# EAGLE design femto (EAGLE 6.4)
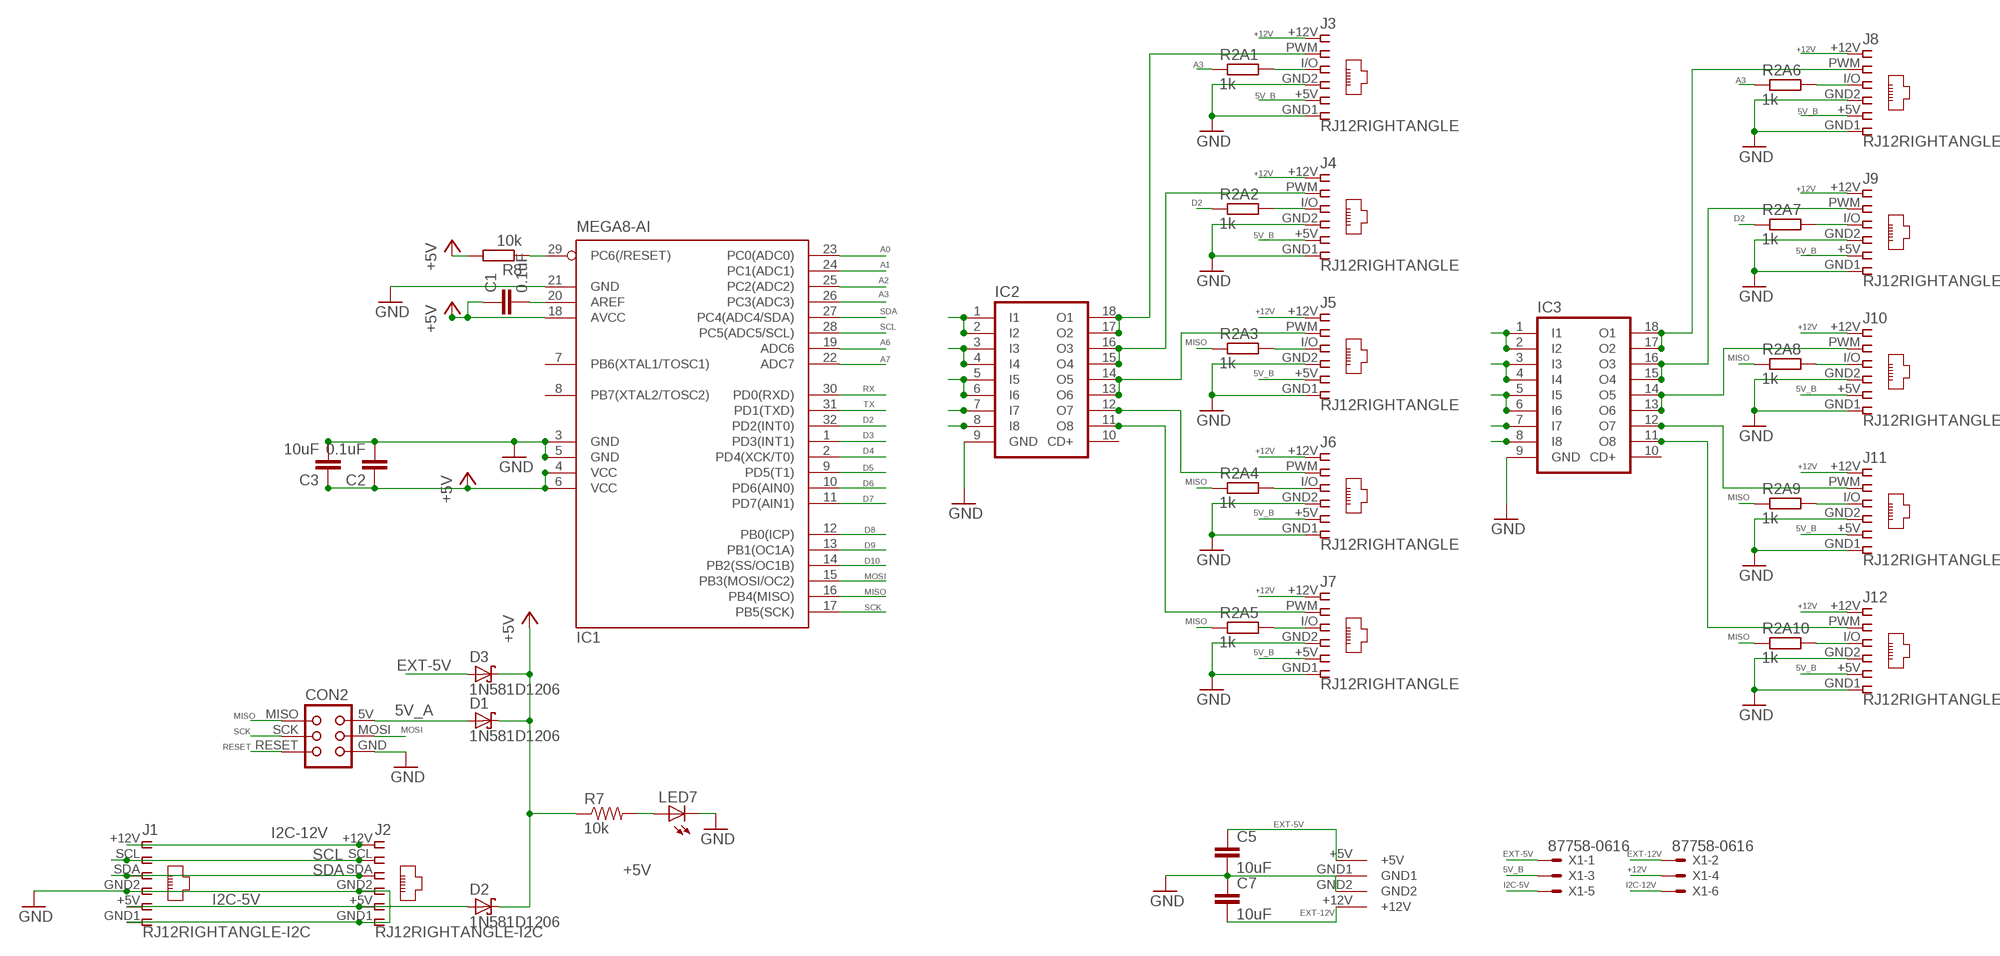
[diagram p0: schematic, sheet 1]

## Parts
C1  0.1uF  C-EUC1206  [C1206]
C2  0.1uF  C-EUC1206  [C1206]
C3  10uF  C-EUC1206  [C1206]
C5  10uF  C-EUC1206  [C1206]
C7  10uF  C-EUC1206  [C1206]
CON2  TINYISPTAG  [TC2030-MCP]
D1  1N581D1206  [LED-1206]
D2  1N581D1206  [LED-1206]
D3  1N581D1206  [LED-1206]
IC1  MEGA8-AI  [TQFP32-08]
IC2  ULN2803A  [SO18W]
IC3  ULN2803A  [SO18W]
J1  RJ12RIGHTANGLE-I2C  [RJ12-RIGHTANGLE-I2C]
J2  RJ12RIGHTANGLE-I2C  [RJ12-RIGHTANGLE-I2C]
J3  RJ12RIGHTANGLE  [RJ12-RIGHTANGLE]
J4  RJ12RIGHTANGLE  [RJ12-RIGHTANGLE]
J5  RJ12RIGHTANGLE  [RJ12-RIGHTANGLE]
J6  RJ12RIGHTANGLE  [RJ12-RIGHTANGLE]
J7  RJ12RIGHTANGLE  [RJ12-RIGHTANGLE]
J8  RJ12RIGHTANGLE  [RJ12-RIGHTANGLE]
J9  RJ12RIGHTANGLE  [RJ12-RIGHTANGLE]
J10  RJ12RIGHTANGLE  [RJ12-RIGHTANGLE]
J11  RJ12RIGHTANGLE  [RJ12-RIGHTANGLE]
J12  RJ12RIGHTANGLE  [RJ12-RIGHTANGLE]
LED7  LEDCHIP-LED0603  [CHIP-LED0603]
R2A1  1k  R-EU_M1206  [M1206]
R2A2  1k  R-EU_M1206  [M1206]
R2A3  1k  R-EU_M1206  [M1206]
R2A4  1k  R-EU_M1206  [M1206]
R2A5  1k  R-EU_M1206  [M1206]
R2A6  1k  R-EU_M1206  [M1206]
R2A7  1k  R-EU_M1206  [M1206]
R2A8  1k  R-EU_M1206  [M1206]
R2A9  1k  R-EU_M1206  [M1206]
R2A10  1k  R-EU_M1206  [M1206]
R7  10k  RESISTOR0603-RES  [0603-RES]
R8  10k  R-EU_M1206  [M1206]
U$1  KPJX-4S-S  [KPJX-4S-S]
X1  87758-0616  [87758-0616]

## Nets
5V_A: CON2.5V(VCC) D1.A
5V_B [power]: J3.+5V J4.+5V J5.+5V J6.+5V J7.+5V J8.+5V J9.+5V J10.+5V J11.+5V J12.+5V X1.3
+5V [power]: C1.1 C2.1 C3.1 D1.C D2.C D3.C IC1.4(VCC) IC1.6(VCC) IC1.18(AVCC) R7.1 R8.2
+12V: J3.+12V J4.+12V J5.+12V J6.+12V J7.+12V J8.+12V J9.+12V J10.+12V J11.+12V J12.+12V X1.4
A0: IC1.23(PC0(ADC0))
A1: IC1.24(PC1(ADC1))
A2: IC1.25(PC2(ADC2))
A3: IC1.26(PC3(ADC3)) R2A1.1 R2A6.1
A6: IC1.19(ADC6)
A7: IC1.22(ADC7)
D2: IC1.32(PD2(INT0)) R2A2.1 R2A7.1
D3: IC1.1(PD3(INT1))
D4: IC1.2(PD4(XCK/T0))
D5: IC1.9(PD5(T1))
D6: IC1.10(PD6(AIN0))
D7: IC1.11(PD7(AIN1))
D8: IC1.12(PB0(ICP))
D9: IC1.13(PB1(OC1A))
D10: IC1.14(PB2(SS/OC1B))
EXT-5V [highpower]: C5.1 D3.A U$1.+5V X1.1
EXT-12V [highpower]: C7.2 U$1.+12V X1.2
GND [power]: C2.2 C3.2 C5.2 C7.1 CON2.GND IC1.3(GND) IC1.5(GND) IC1.21(GND) IC2.9(GND) IC3.9(GND) J1.GND1 J1.GND2 J2.GND1 J2.GND2 J3.GND1 J3.GND2 J4.GND1 J4.GND2 J5.GND1 J5.GND2 J6.GND1 J6.GND2 J7.GND1 J7.GND2 J8.GND1 J8.GND2 J9.GND1 J9.GND2 J10.GND1 J10.GND2 J11.GND1 J11.GND2 J12.GND1 J12.GND2 LED7.C U$1.GND1 U$1.GND2
I2C-5V [power]: D2.A J1.+5V J2.+5V X1.5
I2C-12V: J1.+12V J2.+12V X1.6
MISO: CON2.MISO IC1.16(PB4(MISO)) R2A3.1 R2A4.1 R2A5.1 R2A8.1 R2A9.1 R2A10.1
MOSI: CON2.MOSI IC1.15(PB3(MOSI/OC2))
N$1: IC2.1(I1) IC2.2(I2)
N$2: J3.I/O R2A1.2
N$3: IC2.17(O2) IC2.18(O1) J3.PWM
N$4: C1.2 IC1.20(AREF)
N$5: IC2.15(O4) IC2.16(O3) J4.PWM
N$6: IC2.13(O6) IC2.14(O5) J5.PWM
N$7: IC2.3(I3) IC2.4(I4)
N$8: IC2.5(I5) IC2.6(I6)
N$9: J4.I/O R2A2.2
N$10: J5.I/O R2A3.2
N$11: IC2.12(O7) J6.PWM
N$12: J6.I/O R2A4.2
N$13: IC2.11(O8) J7.PWM
N$14: J7.I/O R2A5.2
N$15: LED7.A R7.2
N$16: IC2.7(I7)
N$17: IC2.8(I8)
N$18: IC3.17(O2) IC3.18(O1) J8.PWM
N$19: IC3.15(O4) IC3.16(O3) J9.PWM
N$20: IC3.13(O6) IC3.14(O5) J10.PWM
N$21: J8.I/O R2A6.2
N$22: J9.I/O R2A7.2
N$23: J10.I/O R2A8.2
N$24: IC3.12(O7) J11.PWM
N$25: J11.I/O R2A9.2
N$26: IC3.11(O8) J12.PWM
N$27: J12.I/O R2A10.2
N$28: IC3.1(I1) IC3.2(I2)
N$29: IC3.3(I3) IC3.4(I4)
N$30: IC3.5(I5) IC3.6(I6)
N$31: IC3.7(I7)
N$32: IC3.8(I8)
RESET: CON2.RESET IC1.29(PC6(/RESET)) R8.1
RX: IC1.30(PD0(RXD))
SCK: CON2.SCK IC1.17(PB5(SCK))
SCL [highpower]: IC1.28(PC5(ADC5/SCL)) J1.SCL J2.SCL
SDA [highpower]: IC1.27(PC4(ADC4/SDA)) J1.SDA J2.SDA
TX: IC1.31(PD1(TXD))
Unconnected: IC1.7(PB6(XTAL1/TOSC1)) IC1.8(PB7(XTAL2/TOSC2)) IC2.10(CD+) IC3.10(CD+)

## Library data of the parts
C1-C3 = resistor:C-EU: CAPACITOR, European symbol
C5 C7 = rcl:C-EU: CAPACITOR, European symbol
CON2 = lpatiny:TINYISP: CONNECTOR
D1-D3 = lpatiny:1N581*: 1.0A SCHOTTKY BARRIER RECTIFIER Source: http://www.diodes.com/datasheets/ds23001.pdf
IC1 = atmel:MEGA8: MICROCONTROLLER 8 Kbytes FLASH, 1 kbytes SRAM, 512 bytes EEPROM, USART, 6-channel 10 bit ADC, 2-channel 8 bit ADC Pin compatible with Atmega48, ATMega88, ATMega168 Source: avr.lbr; MPN: ATMEGA8-16AU; OC_FARNELL: 9171371; OC_NEWARK: 73M8863
IC2 IC3 = lpatiny:ULN2803A: DRIVER ARRAY
J1-J12 = lpatiny:RJ12: CORCOM Modular RJ Jacks No Shield Source: www.tycoelectronics.com .. ENG_DS_1654001_1099_RJ_L_0507.pdf
LED7 = adafruit:LED: LED OSRAM: - CHIPLED LG R971, LG N971, LY N971, LG Q971, LY Q971, LO R971, LY R971 LH N974, LH R974 LS Q976, LO Q976, LY Q976 LO Q996 - Hyper CHIPLED LW Q18S LB Q993, LB Q99A, LB R99A - SideLED LS A670, LO A670, LY A670, LG A670, LP A670 LB A673, LV A673, LT A673, LW A673 LH A674 LY A675 LS A676, LA A676, LO A676, LY A676, LW A676 LS A679, LY A679, LG A679 - Hyper Micro SIDELED® LS Y876, LA Y876, LO Y876, LY Y876 LT Y87S - SmartLED LW L88C, LW L88S LB L89C, LB L89S, LG L890 LS L89K, LO L89K, LY L89K LS L896, LA L896, LO L896, LY L896 - TOPLED LS T670, LO T670, LY T670, LG T670, LP T670 LSG T670, LSP T670, LSY T670, LOP T670, LYG T670 LG T671, LOG T671, LSG T671 LB T673, LV T673, LT T673, LW T673 LH T674 LS T676, LA T676, LO T676, LY T676, LB T676, LH T676, LSB T676, LW T676 LB T67C, LV T67C, LT T67C, LS T67K, LO T67K, LY T67K, LW E67C LS E67B, LA E67B, LO E67B, LY E67B, LB E67C, LV E67C, LT E67C LW T67C LS T679, LY T679, LG T679 LS T770, LO T770, LY T770, LG T770, LP T770 LB T773, LV T773, LT T773, LW T773 LH T774 LS E675, LA E675, LY E675, LS T675 LS T776, LA T776, LO T776, LY T776, LB T776 LHGB T686 LT T68C, LB T68C - Hyper Mini TOPLED® LB M676 - Mini TOPLED Santana® LG M470 LS M47K, LO M47K, LY M47K Source: http://www.osram.convergy.de/
R2A1-R2A10 R8 = resistor:R-EU_: RESISTOR, European symbol
R7 = SparkFun:RESISTOR: Resistor Basic schematic elements and footprints for 0603, 1206, and PTH resistors.
U$1 = lpatiny:KPJX-4S-S
X1 = con-molex:87758-0616: 6 Pin - 2mm Dual Row Single Wafer, Vertical T/H HDR Source: http://www.molex.com/pdm_docs/sd/877580616_sd.pdf; MPN: 87758-0616; OC_FARNELL: 7472323; OC_NEWARK: 25M5667

## Net classes
0 default: width 0.457 mm
1 power: width 0.457 mm
2 highpower: width 1.372 mm
3 fine: width 0.305 mm

## Board
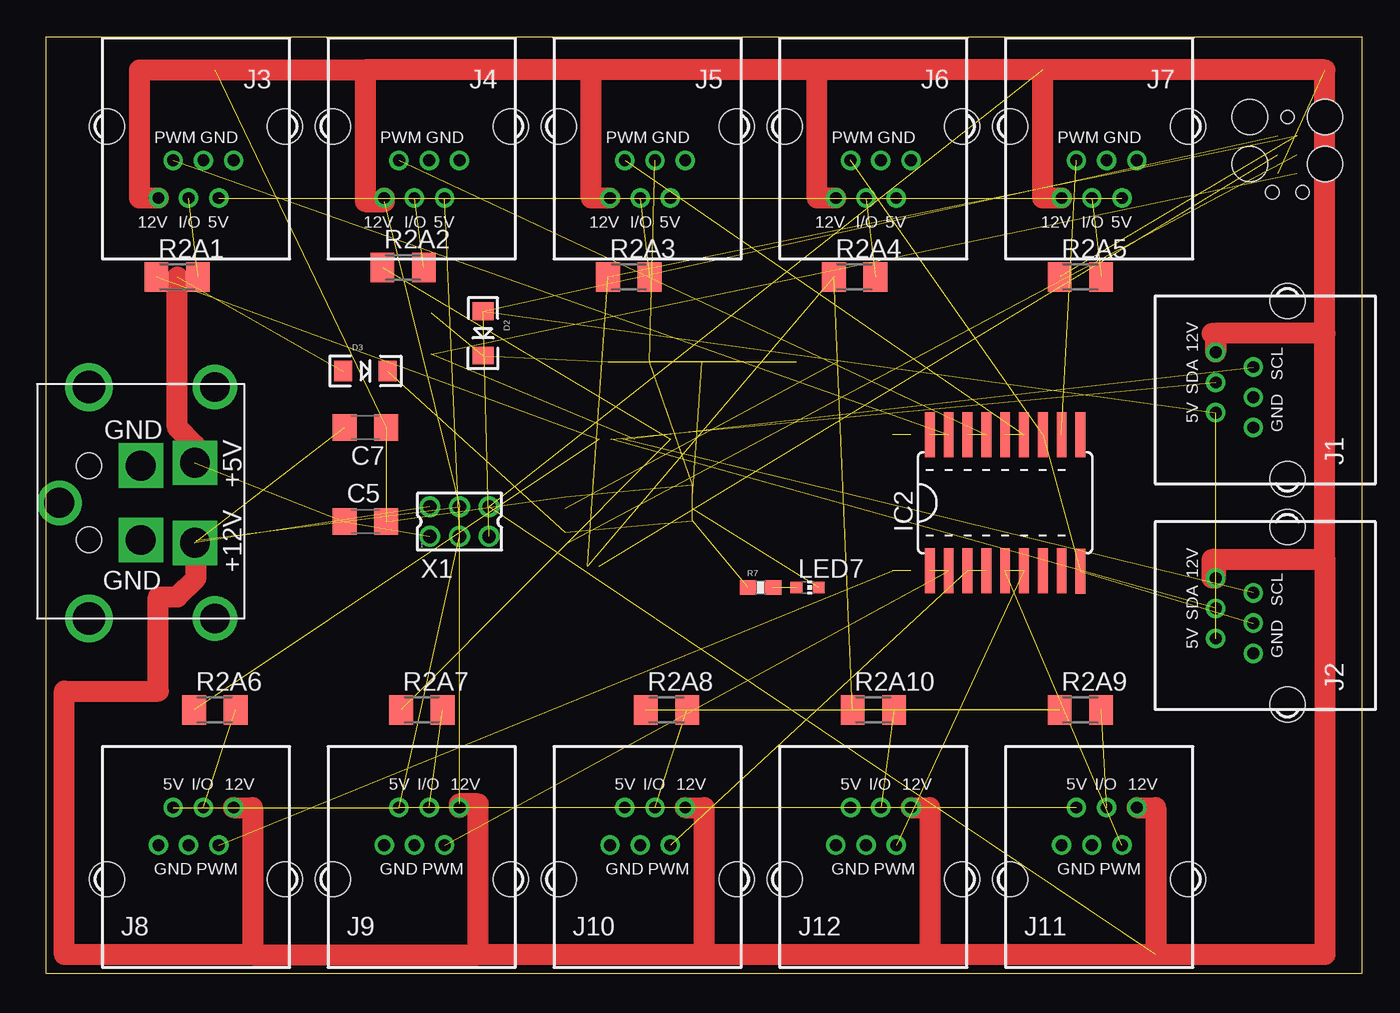
[diagram p1: board, top side]
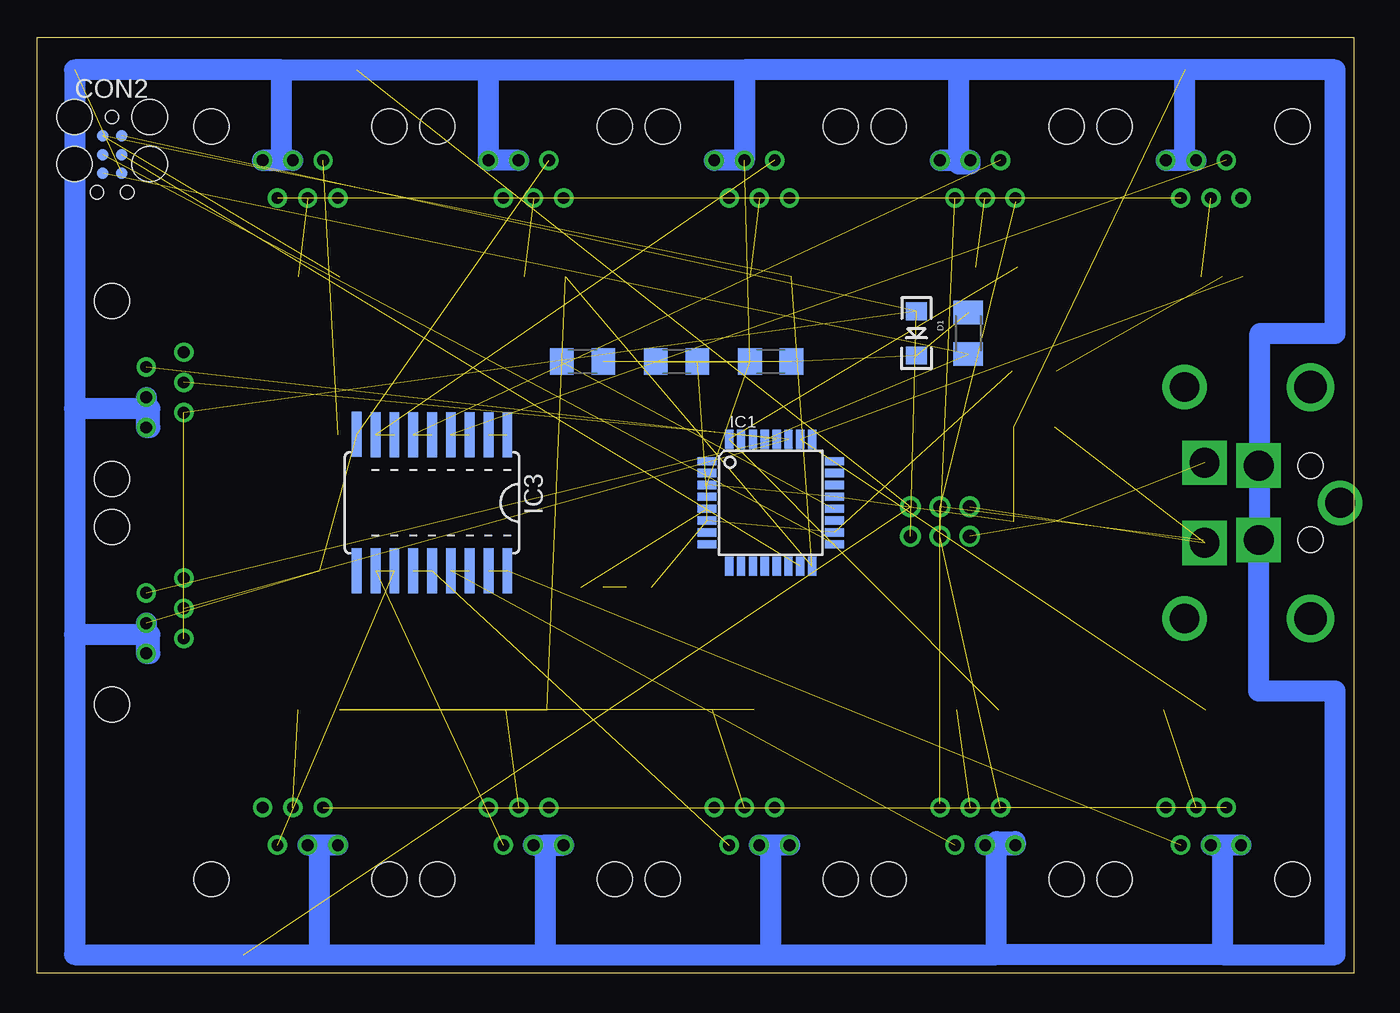
[diagram p2: board, bottom side, seen from below]

Size 88.89 x 63.17 mm. Coordinates in mm from the lower left corner, seen from the top.
Outline: 0,0 88.89,0 88.89,63.17 0,63.17 0,0
Copper layers (1*16): Top 0.035mm / dielectric 1.5mm / Bottom 0.035mm
Design rules "default": minimum track width 6mil, minimum drill 12mil, track to track 6mil, track to pad 6mil, pad to pad 6mil, via to via 6mil, smd to smd 0mil, copper to edge 10mil, drill to drill 10mil, minimum pad ring 10mil, minimum via ring 6mil, stop-mask expansion 2mil, vias tented up to drill 100mil, thermal gap 10mil
vRestrict: area 33,25.4 to 36.8,38.1; area 41.9,25.4 to 45.7,38.1; area 33,25.4 to 45.7,29.2; area 33,34.3 to 45.7,38.1; area 81.3,52.1 to 86.4,58.4

### Footprints (pad centres in the part's own frame; a part is rotated, then mirrored left to right if it is on the bottom)
C1206 = smd 1.6 x 1.8: 1 -1.4,0; 2 1.4,0
TC2030-MCP = smd 0.787 x 0.787: 5V 1.27,0.635; GND 3.81,0.635; MISO 1.27,-0.635; MOSI 2.54,0.635; RESET 3.81,-0.635; SCK 2.54,-0.635 | hole 0.889: 0,0; 5.08,-1.016; 5.08,1.016 | hole 2.375: 0,2.54; 0,-2.54; 3.175,-2.54; 3.175,2.54
LED-1206 = smd 1.2 x 1.4: A -1.5,0; C 1.5,0
TQFP32-08 = smd 1.27 x 0.559: 1 -4.293,2.8; 2 -4.293,2; 3 -4.293,1.2; 4 -4.293,0.4; 5 -4.293,-0.4; 6 -4.293,-1.2; 7 -4.293,-2; 8 -4.293,-2.8; 17 4.293,-2.8; 18 4.293,-2; 19 4.293,-1.2; 20 4.293,-0.4; 21 4.293,0.4; 22 4.293,1.2; 23 4.293,2; 24 4.293,2.8 | smd 0.559 x 1.27: 9 -2.8,-4.293; 10 -2,-4.293; 11 -1.2,-4.293; 12 -0.4,-4.293; 13 0.4,-4.293; 14 1.2,-4.293; 15 2,-4.293; 16 2.8,-4.293; 25 2.8,4.293; 26 2,4.293; 27 1.2,4.293; 28 0.4,4.293; 29 -0.4,4.293; 30 -1.2,4.293; 31 -2,4.293; 32 -2.8,4.293
SO18W = smd 0.66 x 3.048: 1 -5.08,-4.585; 2 -3.81,-4.585; 3 -2.54,-4.585; 4 -1.27,-4.585; 5 0,-4.585; 6 1.27,-4.585; 7 2.54,-4.585; 8 3.81,-4.585; 9 5.08,-4.623; 10 5.08,4.585; 11 3.81,4.585; 12 2.54,4.585; 13 1.27,4.585; 14 0,4.585; 15 -1.27,4.585; 16 -2.54,4.585; 17 -3.81,4.585; 18 -5.08,4.585
RJ12-RIGHTANGLE-I2C = drill 0.8 pad 1.3: +5V -1.54,4.84; +12V 2.54,4.84; GND1 -2.54,2.3; GND2 -0.5,2.3; SCL 1.54,2.3; SDA 0.5,4.84 | hole 2.36: -6,0; 6,0
RJ12-RIGHTANGLE = drill 0.8 pad 1.3: +5V -1.54,4.84; +12V 2.54,4.84; GND1 -2.54,2.3; GND2 -0.5,2.3; I/O 0.5,4.84; PWM 1.54,2.3 | hole 2.36: -6,0; 6,0
CHIP-LED0603 = smd 0.8 x 0.8: A 0,-0.75; C 0,0.75
M1206 = smd 1.6 x 2: 1 -1.4,0; 2 1.4,0
0603-RES = smd 1.1 x 1: 1 -0.85,0; 2 0.85,0
KPJX-4S-S = drill 2 square: +5V 2.7,1.35; +12V -2.7,1.35; GND1 -2.5,5; GND2 2.5,5 | drill 2: P$1 -7.8,0; P$2 7.8,0; P$11 0,10.5 | drill 2.2: P$3 -7.8,8.5; P$4 7.8,8.5 | hole 1.7: -2.5,8.5; 2.5,8.5
87758-0616 = drill 0.9 pad 1.27: 1 -2,-1; 2 -2,1; 3 0,-1; 4 0,1; 5 2,-1; 6 2,1

### Placement (x,y rotation side)
C1  52.07,41.27 180 bottom
C2  45.72,41.27 180 bottom
C3  39.37,41.27 180 bottom
C5  21.59,30.48 0 top
C7  21.59,36.83 180 top
CON2  83.82,57.78 270 bottom
D1  29.53,43.18 270 bottom
D2  29.53,43.18 270 top
D3  21.59,40.64 0 top
IC1  39.37,31.75 0 bottom
IC2  64.77,31.75 0 top
IC3  62.23,31.75 180 bottom
J1  83.82,39.37 90 top
J2  83.82,24.13 90 top
J3  10.16,57.15 180 top
J4  25.4,57.15 180 top
J5  40.64,57.15 180 top
J6  55.88,57.15 180 top
J7  71.12,57.15 180 top
J8  10.16,6.35 0 top
J9  25.4,6.35 0 top
J10  40.64,6.35 0 top
J11  71.12,6.35 0 top
J12  55.88,6.35 0 top
LED7  51.44,26.04 270 top
R2A1  8.89,46.99 0 top
R2A2  24.13,47.62 0 top
R2A3  39.37,46.99 0 top
R2A4  54.61,46.99 0 top
R2A5  69.85,46.99 0 top
R2A6  11.43,17.78 0 top
R2A7  25.4,17.78 0 top
R2A8  41.91,17.78 0 top
R2A9  69.85,17.78 0 top
R2A10  55.88,17.78 0 top
R7  48.26,26.04 0 top
R8  26.04,43.18 90 bottom
U$1  11.43,31.75 90 top
X1  27.94,30.48 0 top

### Tracks (layer width: path | path; a pad name or v marks a point on that pad's centre or on a via)
5V_A  (1 unrouted)
5V_B  (10 unrouted)
+5V  (10 unrouted)
+12V  (3 unrouted)
  Top 1.422: 13.97,1.27 29.21,1.27 | 29.21,1.27 29.21,11.43 27.94,11.43 J9.+12V | J10.+12V 44.45,11.19 44.45,1.27 | 44.45,1.27 29.21,1.27 | J12.+12V 59.69,11.19 59.69,1.27 | 59.69,1.27 44.45,1.27 | J11.+12V 74.93,11.19 74.93,1.27 59.69,1.27 | J3.+12V 6.35,52.31 6.35,60.96 21.59,60.96 | 21.59,60.96 21.59,52.07 22.86,52.07 J4.+12V | J5.+12V 36.83,52.31 36.83,60.96 | 36.83,60.96 21.59,60.96 | J6.+12V 52.07,52.31 52.07,60.96 | 52.07,60.96 36.83,60.96 | J7.+12V 67.31,52.31 67.31,60.96 52.07,60.96 | J8.+12V 13.97,11.19 13.97,1.27 | 13.97,1.27 1.27,1.27 1.27,19.05 7.62,19.05 7.62,25.4 8.89,25.4 10.16,26.67 10.16,29.21
A3  (2 unrouted)
D2  (2 unrouted)
EXT-5V  (3 unrouted)
  Top 1.422: U$1.+5V 10.08,35.64 8.89,36.83 8.89,46.99
EXT-12V  (2 unrouted)
GND  (12 unrouted)
  Bottom 1.422: J3.GND2 J3.GND1 11.43,54.85 11.43,60.96 | 11.43,60.96 26.67,60.96 | 26.67,54.85 26.67,54.61 25.9,54.61 J4.GND2 J4.GND1 26.67,54.85 | 26.67,54.85 26.67,60.96 | 26.67,60.96 41.14,60.96 | 41.14,60.96 J5.GND2 J5.GND1 | J6.GND2 J6.GND1 58.42,60.96 | 58.42,60.96 41.14,60.96 | 72.39,54.85 J7.GND2 J7.GND1 72.39,54.85 | 72.39,60.96 58.42,60.96 | 8.89,8.65 J8.GND2 J8.GND1 8.89,8.65 | 8.89,1.27 24.13,1.27 | 24.13,1.27 24.13,8.89 22.86,8.89 J9.GND1 J9.GND2 | J10.GND1 J10.GND2 39.37,8.65 39.37,1.27 | 39.37,1.27 24.13,1.27 | J12.GND2 J12.GND1 54.61,8.65 54.61,1.27 | 54.61,1.27 39.37,1.27 | J11.GND1 J11.GND2 69.85,8.65 69.85,1.27 | 69.85,1.27 54.61,1.27 | J2.GND2 J2.GND1 81.28,21.59 81.28,22.86 86.36,22.86 | 86.36,22.86 86.36,1.27 69.85,1.27 | J1.GND2 J1.GND1 81.28,36.83 81.28,38.1 86.36,38.1 | 86.36,38.1 86.36,22.86 | 72.39,54.85 72.39,60.96 | 72.39,60.96 86.36,60.96 86.36,38.1 | 8.89,8.65 8.89,1.27 | 8.89,1.27 1.27,1.27 1.27,19.05 6.43,19.05 U$1.GND1 6.35,29.25 6.35,34.29 | 6.35,34.29 6.43,34.29 U$1.GND2 | 6.35,34.29 6.35,43.18 1.27,43.18 1.27,60.96 11.43,60.96
I2C-5V  (3 unrouted)
I2C-12V  (2 unrouted)
  Top 1.422: 86.36,27.94 86.36,43.18 | 86.36,43.18 78.98,43.18 | 78.98,43.18 J1.+12V 78.98,42.94 arc90 78.74,43.18 78.98,43.18 | 78.98,27.94 J2.+12V 78.74,26.67 78.74,27.94 78.98,27.94 | 78.98,27.94 86.36,27.94 | 86.36,27.94 86.36,1.27 74.93,1.27 | 86.36,43.18 86.36,60.96 67.31,60.96
MISO  (7 unrouted)
MOSI  (1 unrouted)
N$1  (1 unrouted)
N$2  (1 unrouted)
N$3  (2 unrouted)
N$4  (1 unrouted)
N$5  (2 unrouted)
N$6  (2 unrouted)
N$7  (1 unrouted)
N$8  (1 unrouted)
N$9  (1 unrouted)
N$10  (1 unrouted)
N$11  (1 unrouted)
N$12  (1 unrouted)
N$13  (1 unrouted)
N$14  (1 unrouted)
N$15  (1 unrouted)
N$18  (2 unrouted)
N$19  (2 unrouted)
N$20  (2 unrouted)
N$21  (1 unrouted)
N$22  (1 unrouted)
N$23  (1 unrouted)
N$24  (1 unrouted)
N$25  (1 unrouted)
N$26  (1 unrouted)
N$27  (1 unrouted)
N$28  (1 unrouted)
N$29  (1 unrouted)
N$30  (1 unrouted)
RESET  (2 unrouted)
SCK  (1 unrouted)
SCL  (2 unrouted)
SDA  (2 unrouted)